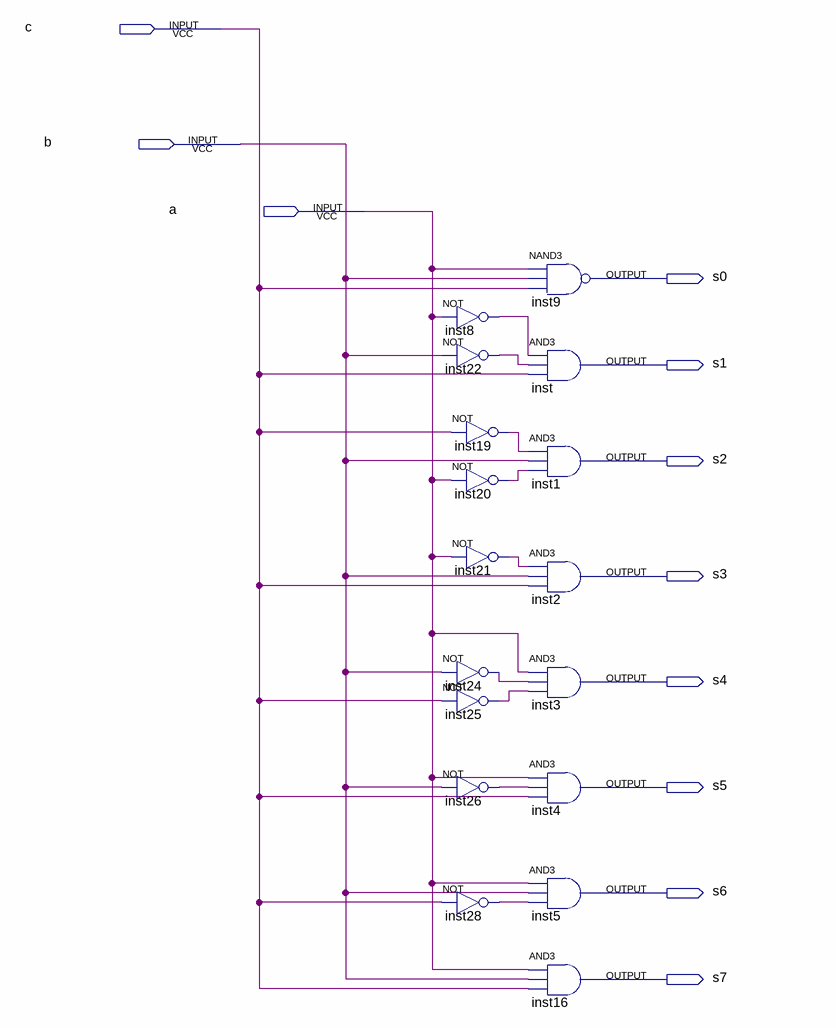
[diagram p0: schematic sheet]
// Quartus schematic decoder3to8.bdf as structural Verilog: 17 symbols, 11 pins
module decoder3to8 (
  input  c,
  input  b,
  input  a,
  output s0,
  output s1,
  output s2,
  output s3,
  output s4,
  output s5,
  output s6,
  output s7
);

  wire inst8_out, inst19_out, inst20_out, inst21_out, inst22_out, inst24_out, inst25_out, inst26_out,
       inst28_out;

  not inst8 (inst8_out, a);
  not inst22 (inst22_out, b);
  not inst19 (inst19_out, c);
  not inst20 (inst20_out, a);
  not inst21 (inst21_out, a);
  not inst24 (inst24_out, b);
  not inst25 (inst25_out, c);
  not inst26 (inst26_out, b);
  not inst28 (inst28_out, c);
  nand inst9 (s0, a, b, c);
  and inst (s1, inst8_out, inst22_out, c);
  and inst1 (s2, inst19_out, b, inst20_out);
  and inst2 (s3, inst21_out, b, c);
  and inst3 (s4, a, inst24_out, inst25_out);
  and inst4 (s5, a, inst26_out, c);
  and inst5 (s6, a, b, inst28_out);
  and inst16 (s7, a, b, c);
endmodule
